# Altium schematic sheet TLayerManager.schDoc
size A4; Organization: Altium Limited; Address1: L3, 12a Rodborough Rd; Address2: Frenchs Forest; Address3: NSW; Address4: Australia 2086; DocumentNumber: 10; SheetNumber: 10; SheetTotal: 22
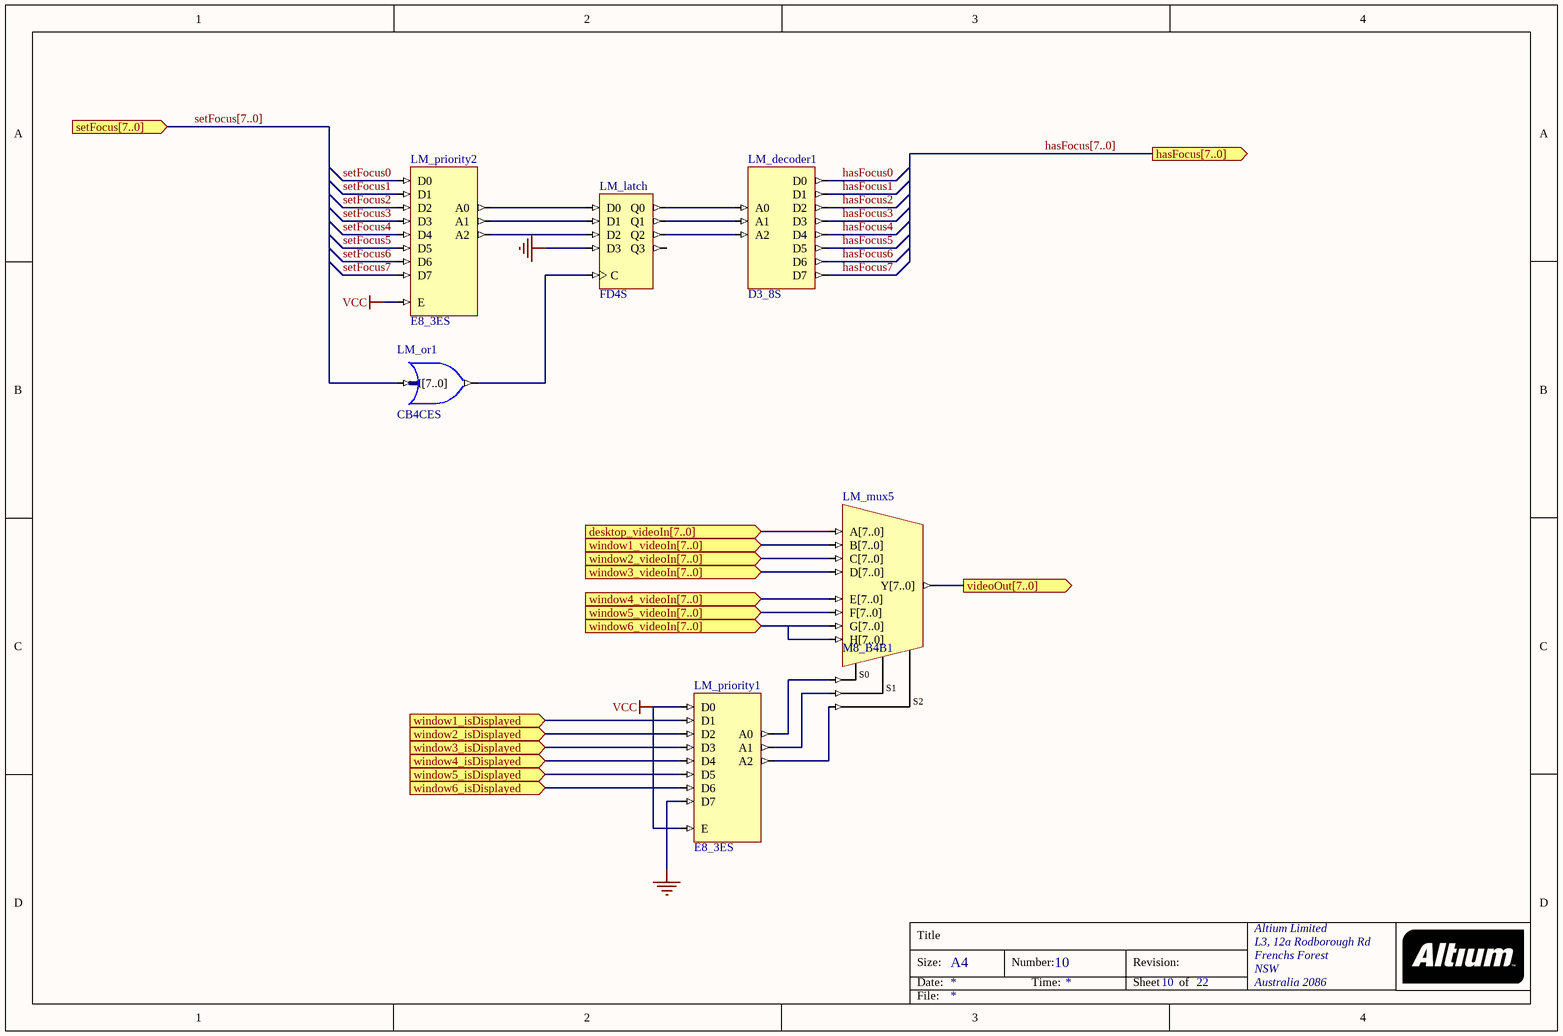
[diagram p0: TLayerManager.schDoc]

## Parts
LM_decoder1  D3_8S
LM_latch  FD4S
LM_mux5  M8_B4B1
LM_or1  CB4CES
LM_priority1  E8_3ES
LM_priority2  E8_3ES

## Ports
desktop_videoIn[7..0] (in), hasFocus[7..0] (out), setFocus[7..0] (in), videoOut[7..0] (out), window1_isDisplayed (in), window1_videoIn[7..0] (in), window2_isDisplayed (in), window2_videoIn[7..0] (in), window3_isDisplayed (in), window3_videoIn[7..0] (in), window4_isDisplayed (in), window4_videoIn[7..0] (in), window5_isDisplayed (in), window5_videoIn[7..0] (in), window6_isDisplayed (in), window6_videoIn[7..0] (in)

## Nets
GND: LM_latch.D3 LM_priority1.D7
VCC: LM_priority1.D0 LM_priority1.E LM_priority2.E
desktop_videoIn[7..0]: LM_mux5.A[7..0] ; port desktop_videoIn[7..0]
hasFocus0: LM_decoder1.D0
hasFocus1: LM_decoder1.D1
hasFocus2: LM_decoder1.D2
hasFocus3: LM_decoder1.D3
hasFocus4: LM_decoder1.D4
hasFocus5: LM_decoder1.D5
hasFocus6: LM_decoder1.D6
hasFocus7: LM_decoder1.D7
setFocus0: LM_priority2.D0
setFocus1: LM_priority2.D1
setFocus2: LM_priority2.D2
setFocus3: LM_priority2.D3
setFocus4: LM_priority2.D4
setFocus5: LM_priority2.D5
setFocus6: LM_priority2.D6
setFocus7: LM_priority2.D7
setFocus[7..0]: LM_or1.I[7..0] ; port setFocus[7..0]
videoOut[7..0]: LM_mux5.Y[7..0] ; port videoOut[7..0]
window1_isDisplayed: LM_priority1.D1 ; port window1_isDisplayed
window1_videoIn[7..0]: LM_mux5.B[7..0] ; port window1_videoIn[7..0]
window2_isDisplayed: LM_priority1.D2 ; port window2_isDisplayed
window2_videoIn[7..0]: LM_mux5.C[7..0] ; port window2_videoIn[7..0]
window3_isDisplayed: LM_priority1.D3 ; port window3_isDisplayed
window3_videoIn[7..0]: LM_mux5.D[7..0] ; port window3_videoIn[7..0]
window4_isDisplayed: LM_priority1.D4 ; port window4_isDisplayed
window4_videoIn[7..0]: LM_mux5.E[7..0] ; port window4_videoIn[7..0]
window5_isDisplayed: LM_priority1.D5 ; port window5_isDisplayed
window5_videoIn[7..0]: LM_mux5.F[7..0] ; port window5_videoIn[7..0]
window6_isDisplayed: LM_priority1.D6 ; port window6_isDisplayed
window6_videoIn[7..0]: LM_mux5.G[7..0] LM_mux5.H[7..0] ; port window6_videoIn[7..0]
NetLM_decoder1_A0: LM_decoder1.A0 LM_latch.Q0
NetLM_decoder1_A1: LM_decoder1.A1 LM_latch.Q1
NetLM_decoder1_A2: LM_decoder1.A2 LM_latch.Q2
NetLM_latch_C: LM_latch.C LM_or1.O
NetLM_latch_D0: LM_latch.D0 LM_priority2.A0
NetLM_latch_D1: LM_latch.D1 LM_priority2.A1
NetLM_latch_D2: LM_latch.D2 LM_priority2.A2
NetLM_mux5_S0: LM_mux5.S0 LM_priority1.A0
NetLM_mux5_S1: LM_mux5.S1 LM_priority1.A1
NetLM_mux5_S2: LM_mux5.S2 LM_priority1.A2

Not connected (* = marked no-connect by the designer): LM_latch Q3

## Buses and harness runs
bus hasFocus[7..0] = port hasFocus[7..0]
bus setFocus[7..0] = port setFocus[7..0]

## Notes on the sheet
- Title
- Size:
- Date:
- A4
- Number:
- Time:
- Revision:
- Sheet
- of
- File:

## Library data of the parts
LM_decoder1 = D3_8S: Binary 3- to 8-Bit Decoder, Single Pin Version; ArchiveName: GENERIC; Published: 9-30-2003; Publisher: Altium Limited; Core Revision: 1.00.00
LM_latch = FD4S: 4-Bit D-Type Flip-Flop, Single Pin Version; Xilinx Equivalent: FD4; ArchiveName: GENERIC; Published: 9-30-2003; Publisher: Altium Limited; Core Revision: 1.00.00
LM_mux5 = M8_B8B1: 8x8-Bit Bus to 1x8-Bit Bus Multiplexer; ArchiveName: GENERIC; Published: 9-30-2003; Publisher: Altium Limited; Core Revision: 1.00.00
LM_or1 = OR8B: 8-Input OR Gate, Bus Version; ArchiveName: GENERIC; Published: 9-30-2003; Publisher: Altium Limited; Core Revision: 1.00.00
LM_priority1 LM_priority2 = E8_3ES: 8- to 3-Bit Priority Encoder with Enable, Single Pin Version; ArchiveName: GENERIC; Published: 9-30-2003; Publisher: Altium Limited; Core Revision: 1.00.00